# Altium project Power-berry_analog.PrjPcb
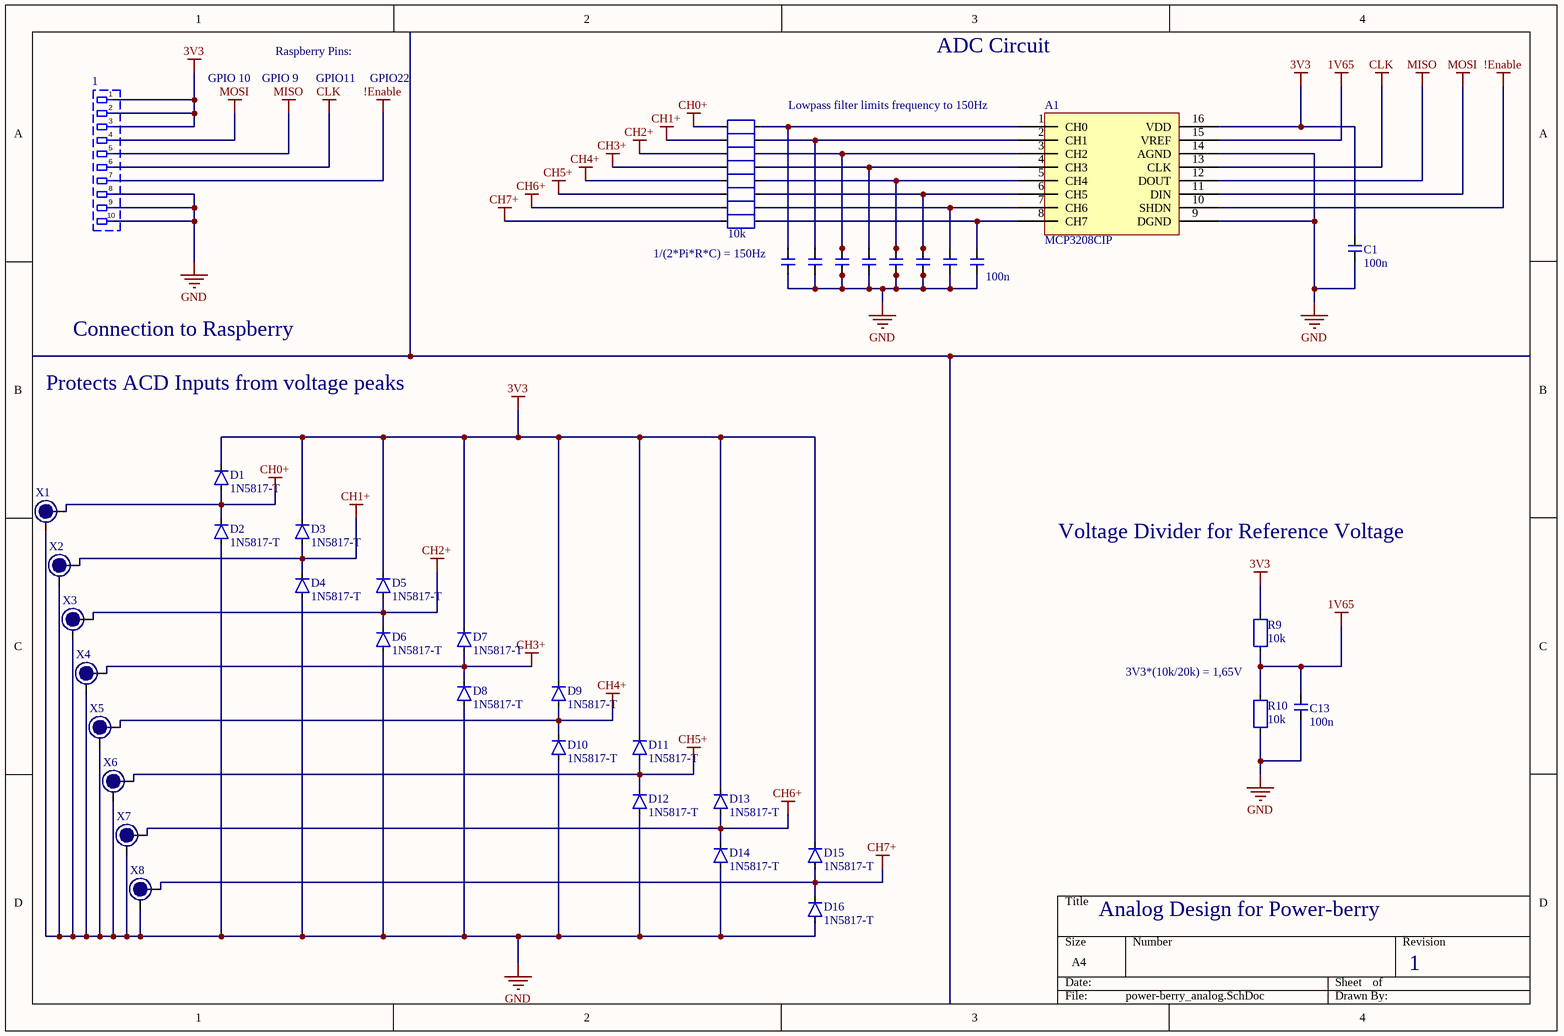
[diagram p0: power-berry_analog.SchDoc]
1 sheet, 49 parts. Net scope: global (net labels, ports and power ports of the same name join across sheets).

## Sheet power-berry_analog.SchDoc
size A4

### Parts
1  Connection to Raspberry
A1  MCP3208CIP
C1  100n  [SMD 1206]
C2  100n  [SMD 1206]  (value not drawn)
C3  100n  [SMD 1206]  (value not drawn)
C4  100n  [SMD 1206]  (value not drawn)
C5  100n  [SMD 1206]  (value not drawn)
C6  100n  [SMD 1206]  (value not drawn)
C7  100n  [SMD 1206]  (value not drawn)
C8  100n  [SMD 1206]  (value not drawn)
C9  100n  [SMD 1206]  (value not drawn)
C10  100n  [SMD 1206]  (value not drawn)
C11  100n  [SMD 1206]  (value not drawn)
C12  100n  [SMD 1206]
C13  100n  [SMD 1206]
D1  1N5817-T  [SMD 0204 MELF D]
D2  1N5817-T  [SMD 0204 MELF D]
D3  1N5817-T  [SMD 0204 MELF D]
D4  1N5817-T  [SMD 0204 MELF D]
D5  1N5817-T  [SMD 0204 MELF D]
D6  1N5817-T  [SMD 0204 MELF D]
D7  1N5817-T  [SMD 0204 MELF D]
D8  1N5817-T  [SMD 0204 MELF D]
D9  1N5817-T  [SMD 0204 MELF D]
D10  1N5817-T  [SMD 0204 MELF D]
D11  1N5817-T  [SMD 0204 MELF D]
D12  1N5817-T  [SMD 0204 MELF D]
D13  1N5817-T  [SMD 0204 MELF D]
D14  1N5817-T  [SMD 0204 MELF D]
D15  1N5817-T  [SMD 0204 MELF D]
D16  1N5817-T  [SMD 0204 MELF D]
R1  WID  [SMD 1206]  (value not drawn)
R2  WID  [SMD 1206]  (value not drawn)
R3  WID  [SMD 1206]  (value not drawn)
R4  WID  [SMD 1206]  (value not drawn)
R5  WID  [SMD 1206]  (value not drawn)
R6  WID  [SMD 1206]  (value not drawn)
R7  WID  [SMD 1206]  (value not drawn)
R8  10k  [SMD 1206]
R9  10k  [SMD 1206]
R10  10k  [SMD 1206]
X1  Hohlbuchse1  [BU HOL 1]  (value not drawn)
X2  Hohlbuchse1  [BU HOL 1]  (value not drawn)
X3  Hohlbuchse1  [BU HOL 1]  (value not drawn)
X4  Hohlbuchse1  [BU HOL 1]  (value not drawn)
X5  Hohlbuchse1  [BU HOL 1]  (value not drawn)
X6  Hohlbuchse1  [BU HOL 1]  (value not drawn)
X7  Hohlbuchse1  [BU HOL 1]  (value not drawn)
X8  Hohlbuchse1  [BU HOL 1]  (value not drawn)

### Nets
1V65: A1.15(VREF) C13.2 R9.1 R10.2
3V3: 1.1 1.2 1.3 A1.16(VDD) C1.2 D1.2 D3.2 D5.2 D7.2 D9.2 D11.2 D13.2 D15.2 R9.2
!Enable: 1.7 A1.10(SHDN)
CH0+: D1.1 D2.2 R1.2 X1.1
CH1+: D3.1 D4.2 R2.2 X2.1
CH2+: D5.1 D6.2 R3.2 X3.1
CH3+: D7.1 D8.2 R4.2 X4.1
CH4+: D9.1 D10.2 R5.2 X5.1
CH5+: D11.1 D12.2 R6.2 X6.1
CH6+: D13.1 D14.2 R7.2 X7.1
CH7+: D15.1 D16.2 R8.2 X8.1
CLK: 1.6 A1.13(CLK)
GND: 1.8 1.9 1.10 A1.9(DGND) A1.14(AGND) C1.1 C2.1 C3.1 C4.1 C5.1 C6.1 C7.1 C8.1 C9.1 C10.1 C11.1 C12.1 C13.1 D2.1 D4.1 D6.1 D8.1 D10.1 D12.1 D14.1 D16.1 R10.1 X1.2 X2.2 X3.2 X4.2 X5.2 X6.2 X7.2 X8.2
MISO: 1.5 A1.12(DOUT)
MOSI: 1.4 A1.11(DIN)
NetA1_1: A1.1(CH0) C2.2 R1.1
NetA1_2: A1.2(CH1) C3.2 R2.1
NetA1_3: A1.3(CH2) C4.2 C5.2 R3.1
NetA1_4: A1.4(CH3) C6.2 R4.1
NetA1_5: A1.5(CH4) C7.2 C8.2 R5.1
NetA1_6: A1.6(CH5) C9.2 C10.2 R6.1
NetA1_7: A1.7(CH6) C11.2 R7.1
NetA1_8: A1.8(CH7) C12.2 R8.1

### Notes on the sheet
- GPIO 10
- GPIO 9
- Raspberry Pins:
- GPIO11
- GPIO22
- Lowpass filter limits frequency to 150Hz
- ADC Circuit
- (near C2) 1/(2*Pi*R*C) = 150Hz
- Protects ACD Inputs from voltage peaks
- Voltage Divider for Reference Voltage
- 3V3*(10k/20k) = 1,65V
- Analog Design for Power-berry
- 1

### Library data of the parts
1 = STIFTLEISTE_10
C1-C13 = KOND: Lieferant: *; Bestell-Nr.: *; Preis: *; Hersteller: *; Bezeichnung: *; Bauform: *; Option: *
D1-D16 = DIODE: Lieferant: *; Bestell-Nr.: *; Preis: *; Hersteller: *; Bezeichnung: *; Bauform: *; Option: *
R8-R10 = WID: Lieferant: *; Bestell-Nr.: *; Preis: *; Hersteller: *; Bezeichnung: *; Bauform: *; Option: *
R1-R7 = WID: Lieferant: *; Bestell-Nr.: *; Preis: *; Hersteller: *; Bezeichnung: *; Bauform: *; Option: *
X1-X8 = Hohlbuchse1: Lieferant: *; Bestell-Nr.: *; Preis: *; Bezeichnung: *; Hersteller: *; Option: *; Bauform: *